# EasyEDA Pro project 光电转接板第二版.eprj

# Schematic Schematic1
Board Name: Board1; Create Date: 2025-05-01; Page Name: P1; Project Name: 光电转接板第二版; Schematic Name: Schematic1; Update Date: 2025-05-06; Company: 嘉立创EDA; Page Size: A4; Version: V1.0
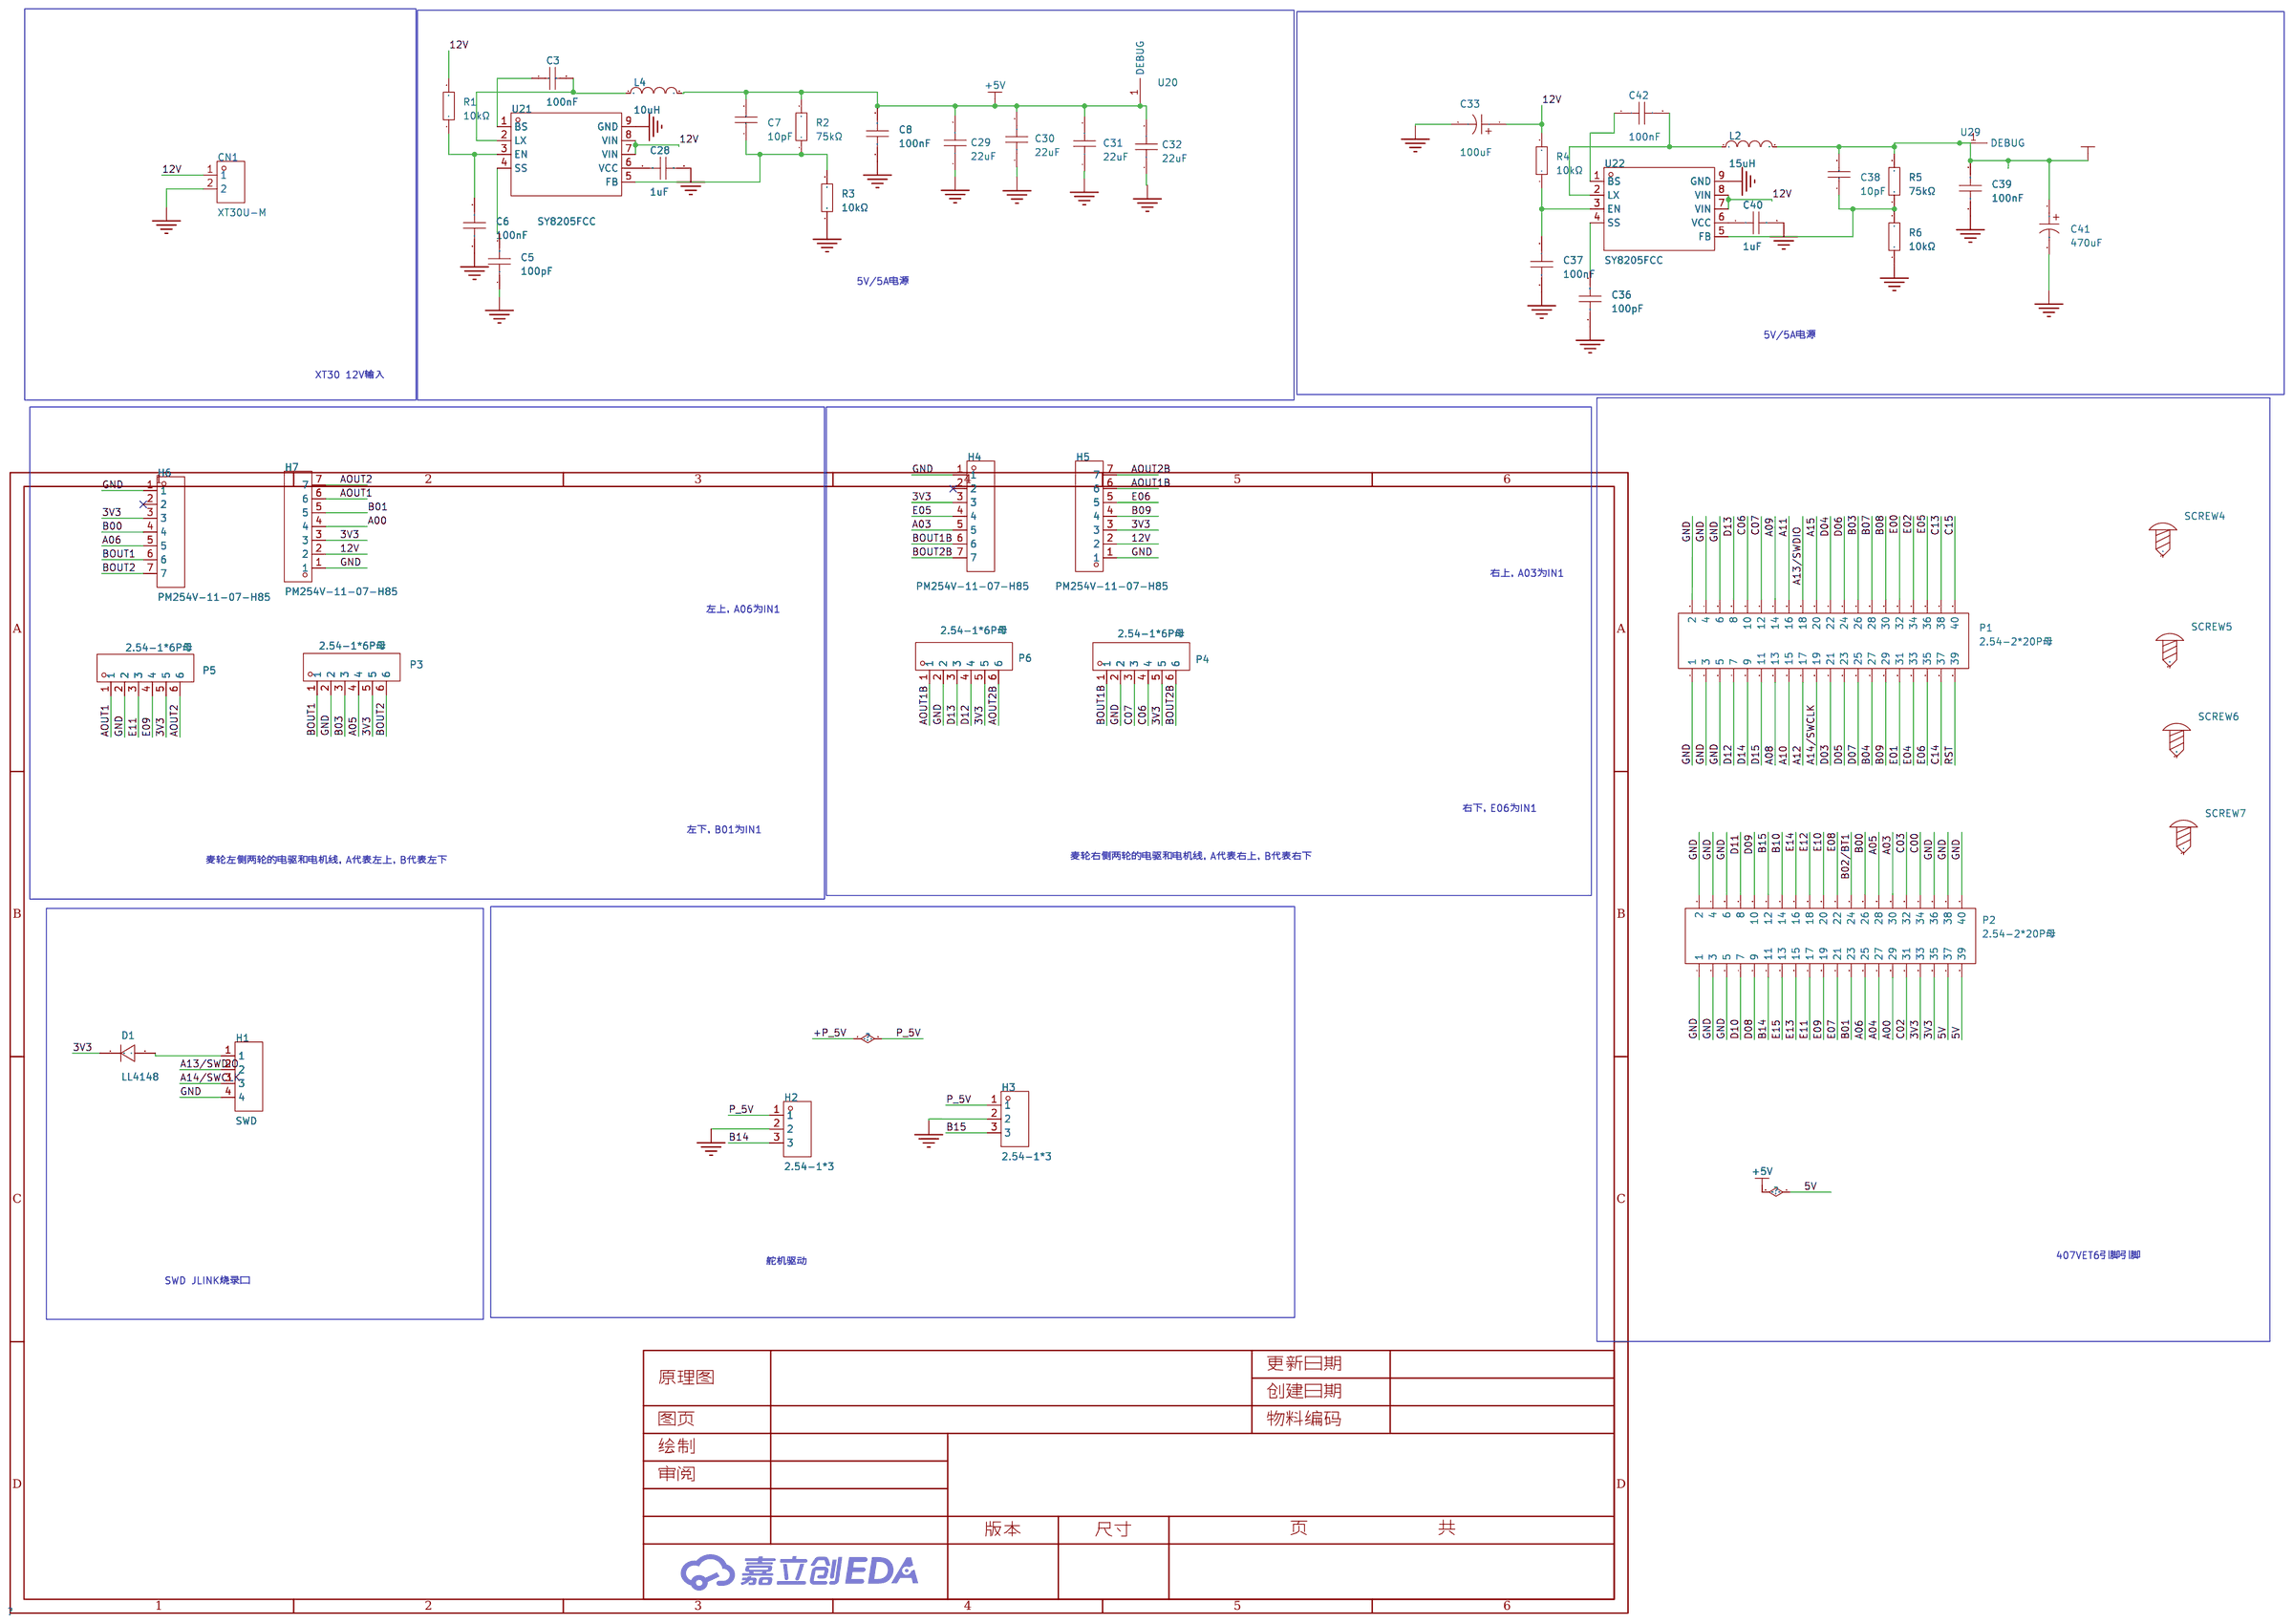
[diagram p0: schematic sheet]

## Parts
C3  100nF  [C1206]
C5  100pF  [C0603]
C6  100nF  [C0603]
C7  10pF  [C0603]
C8  100nF  [C0603]
C28  1uF  [C1206]
C29  22uF  [C0805]
C30  22uF  [C0805]
C31  22uF  [C0805]
C32  22uF  [C0805]
C33  100uF  [CAP-TH_BD6.3-P2.50-D1.0-FD]
C36  100pF  [C0603]
C37  100nF  [C0603]
C38  10pF  [C0603]
C39  100nF  [C0603]
C40  1uF  [C1206]
C41  470uF  [CAP-SMD_BD6.3-L6.6-W6.6-FD]
C42  100nF  [C0603]
CN1  XT30U-M  [CONN-TH_XT30U-M]
D1  LL4148  [LL-34_L3.5-W1.5-RD]
H1  SWD  [HDR-TH_4P-P2.54-H-M-W10.4]
H2  2.54-1*3  [HDR-TH_3P-P2.54-V-M-1]
H3  2.54-1*3  [HDR-TH_3P-P2.54-V-M-1]
H4  PM254V-11-07-H85  [HDR-TH_7P-P2.54-V-F]
H5  PM254V-11-07-H85  [HDR-TH_7P-P2.54-V-F]
H6  PM254V-11-07-H85  [HDR-TH_7P-P2.54-V-F]
H7  PM254V-11-07-H85  [HDR-TH_7P-P2.54-V-F]
L2  15uH  [IND-SMD_L7.1-W6.6]
L4  10uH  [IND-SMD_L5.4-W5.2_FXL0530]
P1  2.54-2*20P母  [HDR-TH_40P-P2.54-V-F-R2-C20-S2.54]
P2  2.54-2*20P母  [HDR-TH_40P-P2.54-V-F-R2-C20-S2.54]
P3  2.54-1*6P母  [HDR-TH_6P-P2.54-V-F]
P4  2.54-1*6P母  [HDR-TH_6P-P2.54-V-F]
P5  2.54-1*6P母  [HDR-TH_6P-P2.54-V-F]
P6  2.54-1*6P母  [HDR-TH_6P-P2.54-V-F]
R1  10kΩ  [R0603]
R2  75kΩ  [R0603]
R3  10kΩ  [R0603]
R4  10kΩ  [R0603]
R5  75kΩ  [R0603]
R6  10kΩ  [R0603]
SCREW4  -  [M3螺丝]
SCREW5  -  [M3螺丝]
SCREW6  -  [M3螺丝]
SCREW7  -  [M3螺丝]
U20  -  [DEBUG]
U21  SY8205FCC  [SOIC-8_L5.0-W4.0-P1.27-LS6.0-BL-EP2.0]
U22  SY8205FCC  [SOIC-8_L5.0-W4.0-P1.27-LS6.0-BL-EP2.0]
U29  -  [DEBUG]

## Library data of the parts
C3 = CL31B104KBCNNNC: 容值:100nF;精度:±10%;额定电压:50V;材质(温度系数):X7R;; LCSC Part Name: 100nF ±10% 50V; Supplier Part: C24497; Manufacturer: SAMSUNG(三星); Supplier Footprint: 1206; JLCPCB Part Class: 基础库; Datasheet: https://atta.szlcsc.com/upload/public/pdf/source/20160218/1457707763339.pdf; Supplier: LCSC; Tolerance: ±10%; Voltage Rated: 50V; Temperature Coefficient: X7R
C5 C36 = CC0603JRNPO9BN101: 容值:100pF;精度:±5%;额定电压:50V;材质(温度系数):NP0;; LCSC Part Name: 100pF ±5% 50V; Supplier Part: C14665; Manufacturer: YAGEO(国巨); Supplier Footprint: 0603; JLCPCB Part Class: 扩展库; Datasheet: https://atta.szlcsc.com/upload/public/pdf/source/20181008/C309499_21CC21451B82C39E3D92150FD6B30293.pdf; Supplier: LCSC; Tolerance: ±5%; Voltage Rated: 50V; Temperature Coefficient: NP0
C6 C8 C37 C39 C42 = CGA0603X7R104K500JT: 容值:100nF;精度:±10%;额定电压:50V;温度系数:X7R;; LCSC Part Name: 100nF ±10% 50V; Supplier Part: C6119867; Manufacturer: HRE(芯声); Supplier Footprint: 0603; JLCPCB Part Class: 扩展库; Datasheet: https://atta.szlcsc.com/upload/public/pdf/source/20250103/C44077DA9E7B3EFAE02F22B6D3D1CBC9.pdf; Supplier: LCSC; Tolerance: ±10%; Voltage Rating: 50V; Temperature Coefficient: X7R
C7 C38 = CC0603JRNPO9BN100: 容值:10pF;精度:±5%;额定电压:50V;材质(温度系数):NP0;; LCSC Part Name: 10pF ±5% 50V; Supplier Part: C106245; Manufacturer: YAGEO(国巨); Supplier Footprint: 0603; JLCPCB Part Class: 扩展库; Datasheet: https://atta.szlcsc.com/upload/public/pdf/source/20170505/1493957838062.pdf; Supplier: LCSC; Tolerance: ±5%; Voltage Rated: 50V; Temperature Coefficient: NP0
C28 C40 = 1206B105K500NT: 容值:1uF;精度:±10%;额定电压:50V;温度系数:X7R;; LCSC Part Name: 1uF ±10% 50V; Supplier Part: C90539; Manufacturer: FH(风华); Supplier Footprint: 1206; JLCPCB Part Class: 扩展库; Datasheet: https://atta.szlcsc.com/upload/public/pdf/source/20200305/C486355_26A10D38EF8C2A5C37091D0039909270.pdf; Supplier: LCSC; Tolerance: ±10%; Voltage Rating: 50V; Temperature Coefficient: X7R
C29-C32 = CGA0805X5R226M350MT: 容值:22uF;精度:±20%;额定电压:35V;材质(温度系数):X5R;; LCSC Part Name: 22uF ±20% 35V; Supplier Part: C6119901; Manufacturer: HRE(芯声); Supplier Footprint: 0805; JLCPCB Part Class: 扩展库; Datasheet: https://atta.szlcsc.com/upload/public/pdf/source/20231129/D589D0CC4D260F7AC3A77E53B455CCB3.pdf; Supplier: LCSC; Tolerance: ±20%; Voltage Rated: 35V; Temperature Coefficient: X5R
C33 = PA25V100M6x5: 容值:100uF;精度:±20%;额定电压:25V;纹波电流:2.69A@100Hz;等效串联电阻(ESR):30mΩ@100kHz;类型:-;; LCSC Part Name: 100uF ±20% 25V; Supplier Part: C46550438; Manufacturer: 捷而瑞; Supplier Footprint: 插件,D6.3xL5mm; JLCPCB Part Class: 扩展库; Datasheet: https://atta.szlcsc.com/upload/public/pdf/source/20250307/831193F737CAF6D75AC25F14E955F0EC.pdf; Supplier: LCSC; Tolerance: ±20%; Voltage Rating: 25V; Ripple Current: 2.69A@100Hz; Equivalent Series Resistance(ESR): 30mΩ@100kHz; Diameter: 6.3mm; Height - Seated (Max): 5mm; Lifetime: 2000hrs@105℃; Operating Temperature: -55℃~+105℃
C41 = GVT1A477M0608CNVC: 容值:470uF;精度:±20%;额定电压:10V;纹波电流:150mA@120Hz;; LCSC Part Name: 470uF ±20% 10V; Supplier Part: C2983309; Manufacturer: HRK(鸿瑞凯电子); Supplier Footprint: SMD,D6.3xL7.7mm; JLCPCB Part Class: 扩展库; Datasheet: https://atta.szlcsc.com/upload/public/pdf/source/20220321/3A4A82F9B7B0C8C257CAAADB11D703EA.pdf; Supplier: LCSC; Tolerance: ±20%; Rated Voltage: 10V; Ripple Current: 150mA@120Hz; φD: 6.3mm; L: 8mm; Lifetime @ Temp: 3000hrs@105℃; Operating Temperature: -55℃~+105℃
CN1 = XT30U-M: 类别:-;类型1:-;; LCSC Part Name: AMASS(艾迈斯)轻量版锂电池插头公头 XT30U-M; Supplier Part: C99101; Manufacturer: AMASS(艾迈斯); Datasheet: https://atta.szlcsc.com/upload/public/pdf/source/20170606/1496716542582.pdf; Supplier: LCSC; Brand: 艾迈斯; Type: 插头; Colour: 黄色; InterfaceType: 公头
D1 = LL4148_C435829: LCSC Part Name: 电压:75V 电流:200mA; Supplier Part: C435829; Manufacturer: MDD(辰达半导体); Supplier Footprint: LL-34; JLCPCB Part Class: 扩展库; Datasheet: https://atta.szlcsc.com/upload/public/pdf/source/20230823/CF1FBF721ECE2AB22ACED5F4B72E76C8.pdf; Supplier: LCSC; Forward Voltage (Vf@If): 1V@10mA; Reverse Voltage (Vr): 75V; Rectified Current: 200mA; Reverse Leakage Current: 5uA@75V; Reverse Recovery Time (trr): 4ns
H1 = 2.54-1*4P反弯排针: 插针结构:1x4P;间距:2.54mm;行距:-;圆针/方针:方针;安装方式:弯插;排数:单排;总PIN位数:4P;额定电流:3A;额定电压:-;配合针长度:6mm;塑高:-;端接针长度:-;触头材质:-;触头镀层:-;工作温度:-55℃~+105℃;颜色:黑色;; LCSC Part Name: 1x4P 间距:2.54mm 方针 弯插; Supplier Part: C91552; Manufacturer: BOOMELE(博穆精密); Supplier Footprint: 弯插,P=2.54mm; Datasheet: https://atta.szlcsc.com/upload/public/pdf/source/20190508/C74252_03DDEC4696EE17172E44B96636392962.pdf; Supplier: LCSC; Pin Structure: 1x4P; Pitch: 2.54mm; Circluar Pins/Square Pins: 方针; Mounting Type: 弯插; Number of Rows: 单排; Number of Pins: 4P; Current Rating: 3A; Length of Mating Pin: 6mm; Operating Temperature: -55℃~+105℃; Color: 黑色
H2 H3 = 2.54-1*3: 插针结构:1x3P;间距:2.54mm;排数:单排;总PIN位数:3P;触头镀层:金;; LCSC Part Name: 停产; Supplier Part: C5116482; Manufacturer: ZHOURI(洲日); Supplier Footprint: 插件,P=2.54mm; JLCPCB Part Class: 扩展库; Datasheet: https://atta.szlcsc.com/upload/public/pdf/source/20220729/4DB71EF9013296CFACD97372BAB8A1F0.pdf; Supplier: LCSC; Pin Structure: 1x3P; Pitch: 2.54mm; Number of Rows: 单排; Number of Pins: 3P; Contact Plating: 金
H4-H7 = PM254V-11-07-H85: 插孔结构:1x7P;间距:2.54mm;行距:-;圆孔/方孔:方孔;安装类型:直插;排数:单排;总孔位数:7P;额定电流:3A;额定电压:250V;插孔方向:顶部;塑高:-;工作温度范围:-40℃~+105℃;; LCSC Part Name: 间距:2.54mm 1x7P 直插; Supplier Part: C2832270; Manufacturer: XFCN(兴飞); Supplier Footprint: 插件,P=2.54mm; JLCPCB Part Class: 扩展库; Datasheet: https://atta.szlcsc.com/upload/public/pdf/source/20210514/C2832270_F424CC0071A81298BFB56B53406F9842.pdf; Supplier: LCSC; Holes Structure: 1x7P; Pitch: 2.54mm; Circular Hole / Square Hole: 方孔; Mounting Type: 直插; Number of Rows: 单排; Number of Holes: 7P; Current Rating (Max): 3A; Voltage Rating (Max): 250V; Holes Direction: 顶部; Operating Temperature Range: -40℃~+105℃
L2 = SMMS0650-150M: 电感值:15uH;精度:±20%;额定电流:3.1A;饱和电流(Isat):5A;类型:一体成型电感;; LCSC Part Name: 15uH ±20% 5A; Supplier Part: C149585; Manufacturer: SXN(顺翔诺); Supplier Footprint: SMD,6.6x7.1mm; JLCPCB Part Class: 扩展库; Datasheet: https://atta.szlcsc.com/upload/public/pdf/source/20210810/BBF24330FB2F5029F637830BA9C42C0D.pdf; Supplier: LCSC; Tolerance: ±20%; Rated Current: 3.1A; Saturation Current (Isat): 5A; DC Resistance (DCR): 85mΩ; Type: 一体成型电感
L4 = FXL0530-100-M: 电感值:10uH;精度:±20%;额定电流:3.2A;饱和电流(Isat):3.5A;类型:一体成型电感;; LCSC Part Name: 10uH ±20% 3.5A; Supplier Part: C177248; Manufacturer: cjiang(长江微电); Supplier Footprint: SMD,5.2x5.4mm; JLCPCB Part Class: 扩展库; Datasheet: https://atta.szlcsc.com/upload/public/pdf/source/20240426/3189EA8206330E2108542F9E34E540E7.pdf; Supplier: LCSC; Tolerance: ±20%; Rated Current: 3.2A; Saturation Current (Isat): 3.5A; DC Resistance (DCR): 125mΩ; Type: 一体成型电感
P1 P2 = 2.54-2*20P母: 间距:2.54mm;总孔位数:40;排数:2;插孔结构:2x20P;行距:2.54mm;安装类型:直插;塑高:-;触头材质:黄铜;触头镀层:-;; LCSC Part Name: 2.54mm 2x20P; Supplier Part: C50982; Manufacturer: BOOMELE(博穆精密); Supplier Footprint: 直插,P=2.54mm; JLCPCB Part Class: Extended Part; Datasheet: https://atta.szlcsc.com/upload/public/pdf/source/20151109/1457707571530.pdf; Supplier: LCSC; Pitch: 2.54mm; Number of Holes: 40; Number of Rows: 2; Holes Structure: 2x20P; Row Spacing: 2.54mm; Mounting Type: 直插; Contact Material: 黄铜
P3-P6 = 2.54-1*6P母: 间距:2.54mm;总孔位数:6;排数:1;插孔结构:1x6P;行距:-;安装类型:直插;塑高:-;触头材质:-;触头镀层:-;; LCSC Part Name: 2.54mm 1x6P; Supplier Part: C40877; Manufacturer: BOOMELE(博穆精密); Supplier Footprint: 直插,P=2.54mm; JLCPCB Part Class: Extended Part; Datasheet: https://atta.szlcsc.com/upload/public/pdf/source/20151109/1457707559772.pdf; Supplier: LCSC; Pitch: 2.54mm; Number of Holes: 6; Number of Rows: 1; Holes Structure: 1x6P; Mounting Type: 直插
R1 R3 R4 R6 = 0603WAF1002T5E: 电阻类型:厚膜电阻;阻值:10kΩ;精度:±1%;功率:100mW;最大工作电压:75V;温度系数:±100ppm/℃;; LCSC Part Name: 厚膜电阻 10kΩ ±1% 100mW; Supplier Part: C25804; Manufacturer: UNI-ROYAL(厚声); Supplier Footprint: 0603; JLCPCB Part Class: 基础库; Datasheet: https://atta.szlcsc.com/upload/public/pdf/source/20200306/C422600_1E6D84923E4A46A82E41ADD87F860B5C.pdf; Supplier: LCSC; Type: 厚膜电阻; Tolerance: ±1%; Power(Watts): 100mW; Overload Voltage (Max): 75V; Temperature Coefficient: ±100ppm/℃; Operating Temperature Range: -55℃~+155℃
R2 R5 = 0603WAF7502T5E: 电阻类型:厚膜电阻;阻值:75kΩ;精度:±1%;功率:100mW;最大工作电压:75V;温度系数:±100ppm/℃;; LCSC Part Name: 75kΩ ±1% 100mW 厚膜电阻; Supplier Part: C23242; Manufacturer: UNI-ROYAL(厚声); Supplier Footprint: 0603; JLCPCB Part Class: 基础库; Datasheet: https://atta.szlcsc.com/upload/public/pdf/source/20200306/C422600_1E6D84923E4A46A82E41ADD87F860B5C.pdf; Supplier: LCSC; Type: 厚膜电阻; Tolerance: ±1%; Power(Watts): 100mW; Overload Voltage (Max): 75V; Temperature Coefficient: ±100ppm/℃; Operating Temperature Range: -55℃~+155℃
SCREW4-SCREW7 = M3螺丝: Supplier Footprint: 插件
U20 U29 = DEBUG
U21 U22 = SY8205FCC: 功能类型:降压型;输出类型:-;工作电压:4.5V~30V;输出电压:-;输出电流:5A;; LCSC Part Name: 高效快速响应5A 30V输入同步降压稳压器; Supplier Part: C111875; Manufacturer: silergy(矽力杰); Supplier Footprint: SOIC-8-EP; JLCPCB Part Class: 扩展库; Datasheet: https://atta.szlcsc.com/upload/public/pdf/source/20180224/C111875_15194360670851363275.pdf; Supplier: LCSC; Function: 降压型; Input Voltage: 4.5V~30V; Output Current: 5A; Switching Frequency: 500kHz; Operating Temperature: -40℃~+125℃; Synchronous Rectification: 是; Topology: 降压式; Quiescent Current (Iq): 200uA; Switch tube (built-in/external): 内置

## Nets
3V3: D1.1(C) H4.3 H5.3 H6.3 H7.3 P2.33 P2.35 P3.5 P4.5 P5.5 P6.5
12V: C33.1 CN1.1 H5.2 H7.2 R1.2 R4.2 U21.7(VIN) U21.8(VIN) U22.7(VIN) U22.8(VIN)
+5V: C7.2 C8.2 C29.2 C30.2 C31.2 C32.2 L4.2 P2.37 P2.39 R2.2 U20.1(DEBUG)
GND: C5.1 C6.1 C8.1 C28.2 C32.1 C33.2 C36.1 C37.1 C39.1 C40.2 CN1.2 H1.4 H3.2 H4.1 H5.1 H6.1 H7.1 P1.1 P1.2 P1.3 P1.4 P1.5 P1.6 P2.1 P2.2 P2.3 P2.4 P2.5 P2.6 P2.36 P2.38 P2.40 P3.2 P4.2 P5.2 P6.2 R3.1 R6.1 U21.9(GND) U22.9(GND)
+P_5V: C38.2 C39.2 C41.1 H2.1 H3.1 L2.2 R5.2 U29.1(DEBUG)
A00: H7.4 P2.29
A03: H4.5 P2.30
A04: P2.27
A05: P2.28 P3.4
A06: H6.5 P2.25
A08: P1.13
A09: P1.14
A10: P1.15
A11: P1.16
A12: P1.17
A13/SWDIO: H1.2 P1.18
A14/SWCLK: H1.3 P1.19
A15: P1.20
AOUT1: H7.6 P5.1
AOUT1B: H5.6 P6.1
AOUT2: H7.7 P5.6
AOUT2B: H5.7 P6.6
B00: H6.4 P2.26
B01: H7.5 P2.23
B02/BT1: P2.24
B03: P1.26 P3.3
B04: P1.27
B07: P1.28
B08: P1.30
B09: H5.4 P1.29
B10: P2.14
B14: H2.3 P2.11
B15: H3.3 P2.12
BOUT1: H6.6 P3.1
BOUT1B: H4.6 P4.1
BOUT2: H6.7 P3.6
BOUT2B: H4.7 P4.6
C00: P2.34
C02: P2.31
C03: P2.32
C06: P1.10 P4.4
C07: P1.12 P4.3
C13: P1.38
C14: P1.37
C15: P1.40
D03: P1.21
D04: P1.22
D05: P1.23
D06: P1.24
D07: P1.25
D08: P2.9
D09: P2.10
D10: P2.7
D11: P2.8
D12: P1.7 P6.4
D13: P1.8 P6.3
D14: P1.9
D15: P1.11
E00: P1.32
E01: P1.31
E02: P1.34
E04: P1.33
E05: H4.4 P1.36
E06: H5.5 P1.35
E07: P2.21
E08: P2.22
E09: P2.19 P5.4
E10: P2.20
E11: P2.17 P5.3
E12: P2.18
E13: P2.15
E14: P2.16
E15: P2.13
RST: P1.39
$1N856: C3.2 L4.1 U21.2(LX)
$1N857: C7.1 R2.1 R3.2 U21.5(FB)
$1N858: C5.2 U21.4(SS)
$1N864: C6.2 R1.1 U21.3(EN)
$1N865: C28.1 U21.6(VCC)
$1N867: C3.1 U21.1(BS)
$1N1560: C38.1 R5.1 R6.2 U22.5(FB)
$1N1561: C36.2 U22.4(SS)
$1N1567: C37.2 R4.1 U22.3(EN)
$1N1568: C40.1 U22.6(VCC)
$1N1570: C42.1 U22.1(BS)
$1N2169: D1.2(A) H1.1
$1N7357: C42.2 L2.1 U22.2(LX)

Not connected (* = marked no-connect by the designer): C29 1; C30 1; C31 1; C41 2; H2 2; H4 2*; H6 2*; SCREW4 1; SCREW5 1; SCREW6 1; SCREW7 1

## Notes on the sheet
- 5V/5A电源
- 5V/5A电源
- XT30 12V输入
- 右上，A03为IN1
- 左上，A06为IN1
- 右下，E06为IN1
- 左下，B01为IN1
- 麦轮左侧两轮的电驱和电机线，A代表左上，B代表左下
- 麦轮右侧两轮的电驱和电机线，A代表右上，B代表右下
- 舵机驱动
- 407VET6引脚引脚
- SWD JLINK烧录口

# Schematic Schematic2
Create Date: 2025-05-05; Page Name: P1; Project Name: 光电转接板第二版; Schematic Name: Schematic2; Update Date: 2025-05-06; Company: 嘉立创EDA; Page Size: A4; Version: V1.0
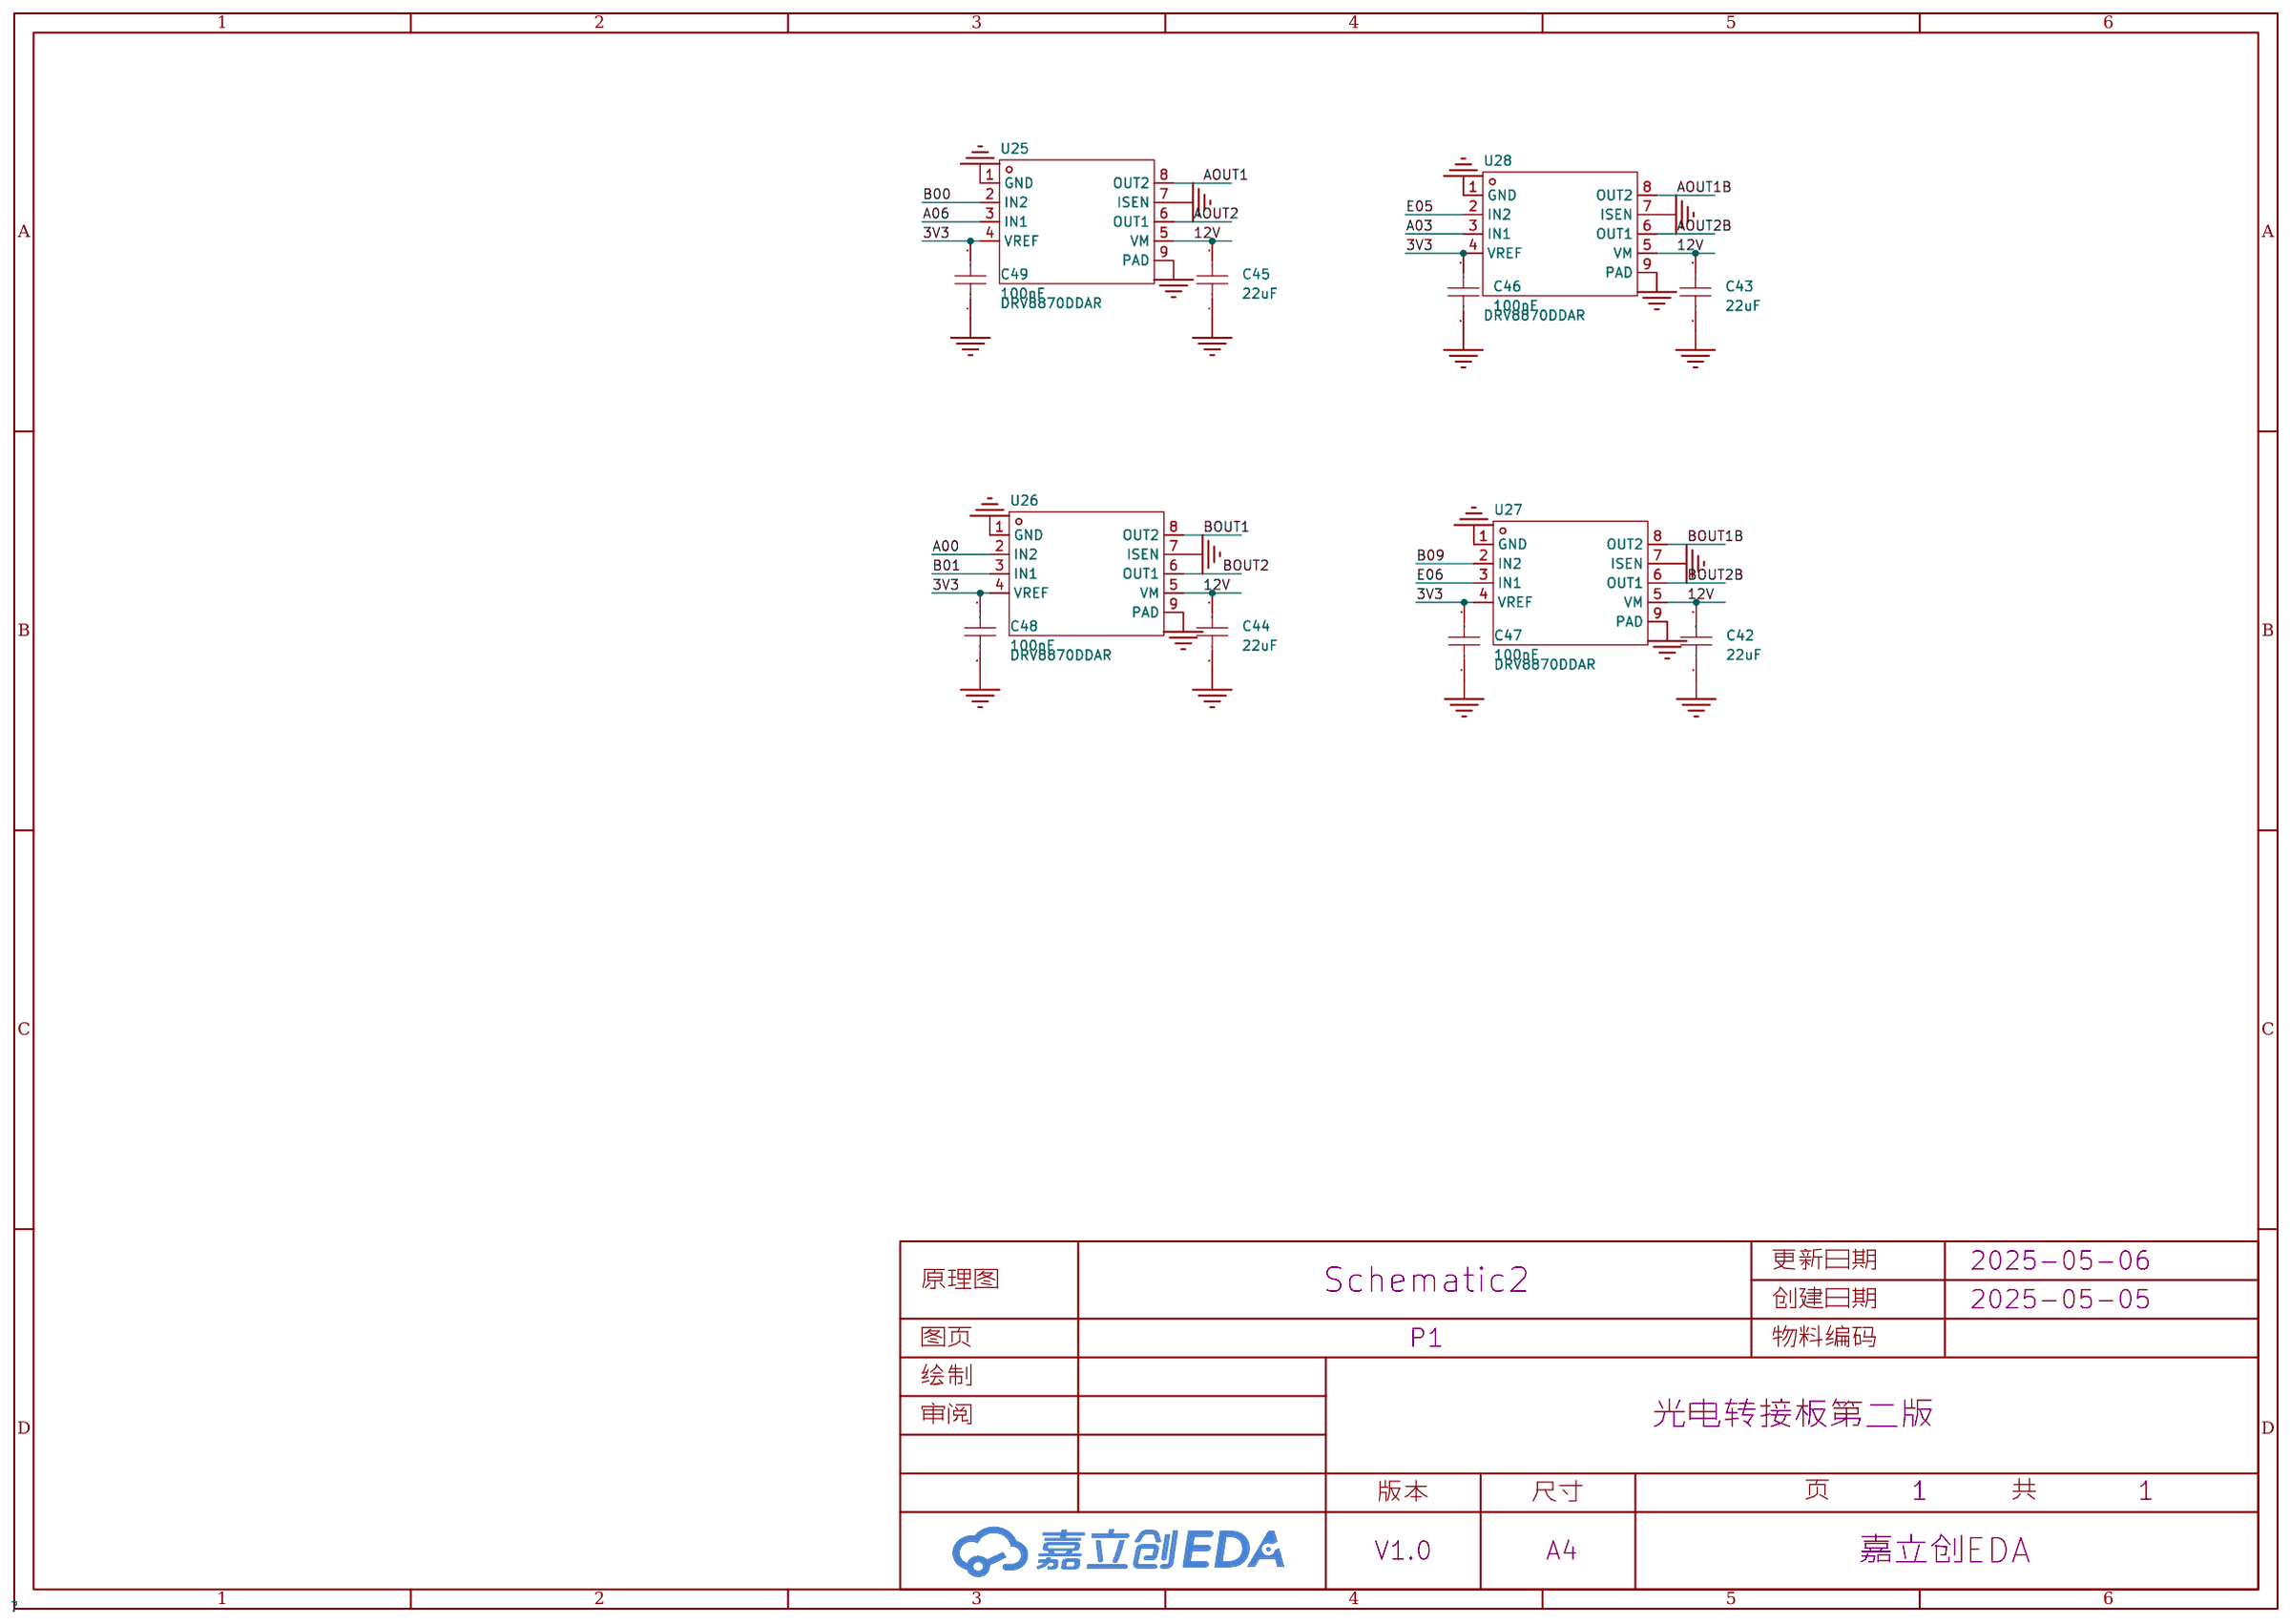
[diagram p1: schematic sheet]

## Parts
C42  22uF  [C0805]
C43  22uF  [C0805]
C44  22uF  [C0805]
C45  22uF  [C0805]
C46  100nF  [C0603]
C47  100nF  [C0603]
C48  100nF  [C0603]
C49  100nF  [C0603]
U25  DRV8870DDAR  [HSOP-8_L5.0-W4.0-P1.27-LS6.2-BL-EP]
U26  DRV8870DDAR  [HSOP-8_L5.0-W4.0-P1.27-LS6.2-BL-EP]
U27  DRV8870DDAR  [HSOP-8_L5.0-W4.0-P1.27-LS6.2-BL-EP]
U28  DRV8870DDAR  [HSOP-8_L5.0-W4.0-P1.27-LS6.2-BL-EP]

## Library data of the parts
C42-C45 = CGA0805X5R226M350MT: 容值:22uF;精度:±20%;额定电压:35V;材质(温度系数):X5R;; LCSC Part Name: 22uF ±20% 35V; Supplier Part: C6119901; Manufacturer: HRE(芯声); Supplier Footprint: 0805; JLCPCB Part Class: 扩展库; Datasheet: https://atta.szlcsc.com/upload/public/pdf/source/20231129/D589D0CC4D260F7AC3A77E53B455CCB3.pdf; Supplier: LCSC; Tolerance: ±20%; Voltage Rated: 35V; Temperature Coefficient: X5R
C46-C49 = CGA0603X7R104K500JT: 容值:100nF;精度:±10%;额定电压:50V;温度系数:X7R;; LCSC Part Name: 100nF ±10% 50V; Supplier Part: C6119867; Manufacturer: HRE(芯声); Supplier Footprint: 0603; JLCPCB Part Class: 扩展库; Datasheet: https://atta.szlcsc.com/upload/public/pdf/source/20250103/C44077DA9E7B3EFAE02F22B6D3D1CBC9.pdf; Supplier: LCSC; Tolerance: ±10%; Voltage Rating: 50V; Temperature Coefficient: X7R
U25-U28 = DRV8870DDAR: DRV8870 具有电流调节功能的 50V、3.6A、H 桥电机驱动器; Supplier Part: C86590; Manufacturer: TI(德州仪器); Supplier Footprint: HSOP-8-EP; JLCPCB Part Class: 扩展库; Datasheet: https://www.ti.com/cn/lit/gpn/drv8870; Supplier: LCSC

## Nets
3V3: C46.2 C47.2 C48.2 C49.2 U25.4(VREF) U26.4(VREF) U27.4(VREF) U28.4(VREF)
12V: C42.2 C43.2 C44.2 C45.2 U25.5(VM) U26.5(VM) U27.5(VM) U28.5(VM)
GND: C42.1 C43.1 C44.1 C45.1 C46.1 C47.1 C48.1 C49.1 U25.1(GND) U25.7(ISEN) U25.9(PAD) U26.1(GND) U26.7(ISEN) U26.9(PAD) U27.1(GND) U27.7(ISEN) U27.9(PAD) U28.1(GND) U28.7(ISEN) U28.9(PAD)
A00: U26.2(IN2)
A03: U28.3(IN1)
A06: U25.3(IN1)
AOUT1: U25.8(OUT2)
AOUT1B: U28.8(OUT2)
AOUT2: U25.6(OUT1)
AOUT2B: U28.6(OUT1)
B00: U25.2(IN2)
B01: U26.3(IN1)
B09: U27.2(IN2)
BOUT1: U26.8(OUT2)
BOUT1B: U27.8(OUT2)
BOUT2: U26.6(OUT1)
BOUT2B: U27.6(OUT1)
E05: U28.2(IN2)
E06: U27.3(IN1)

# Board PCB1
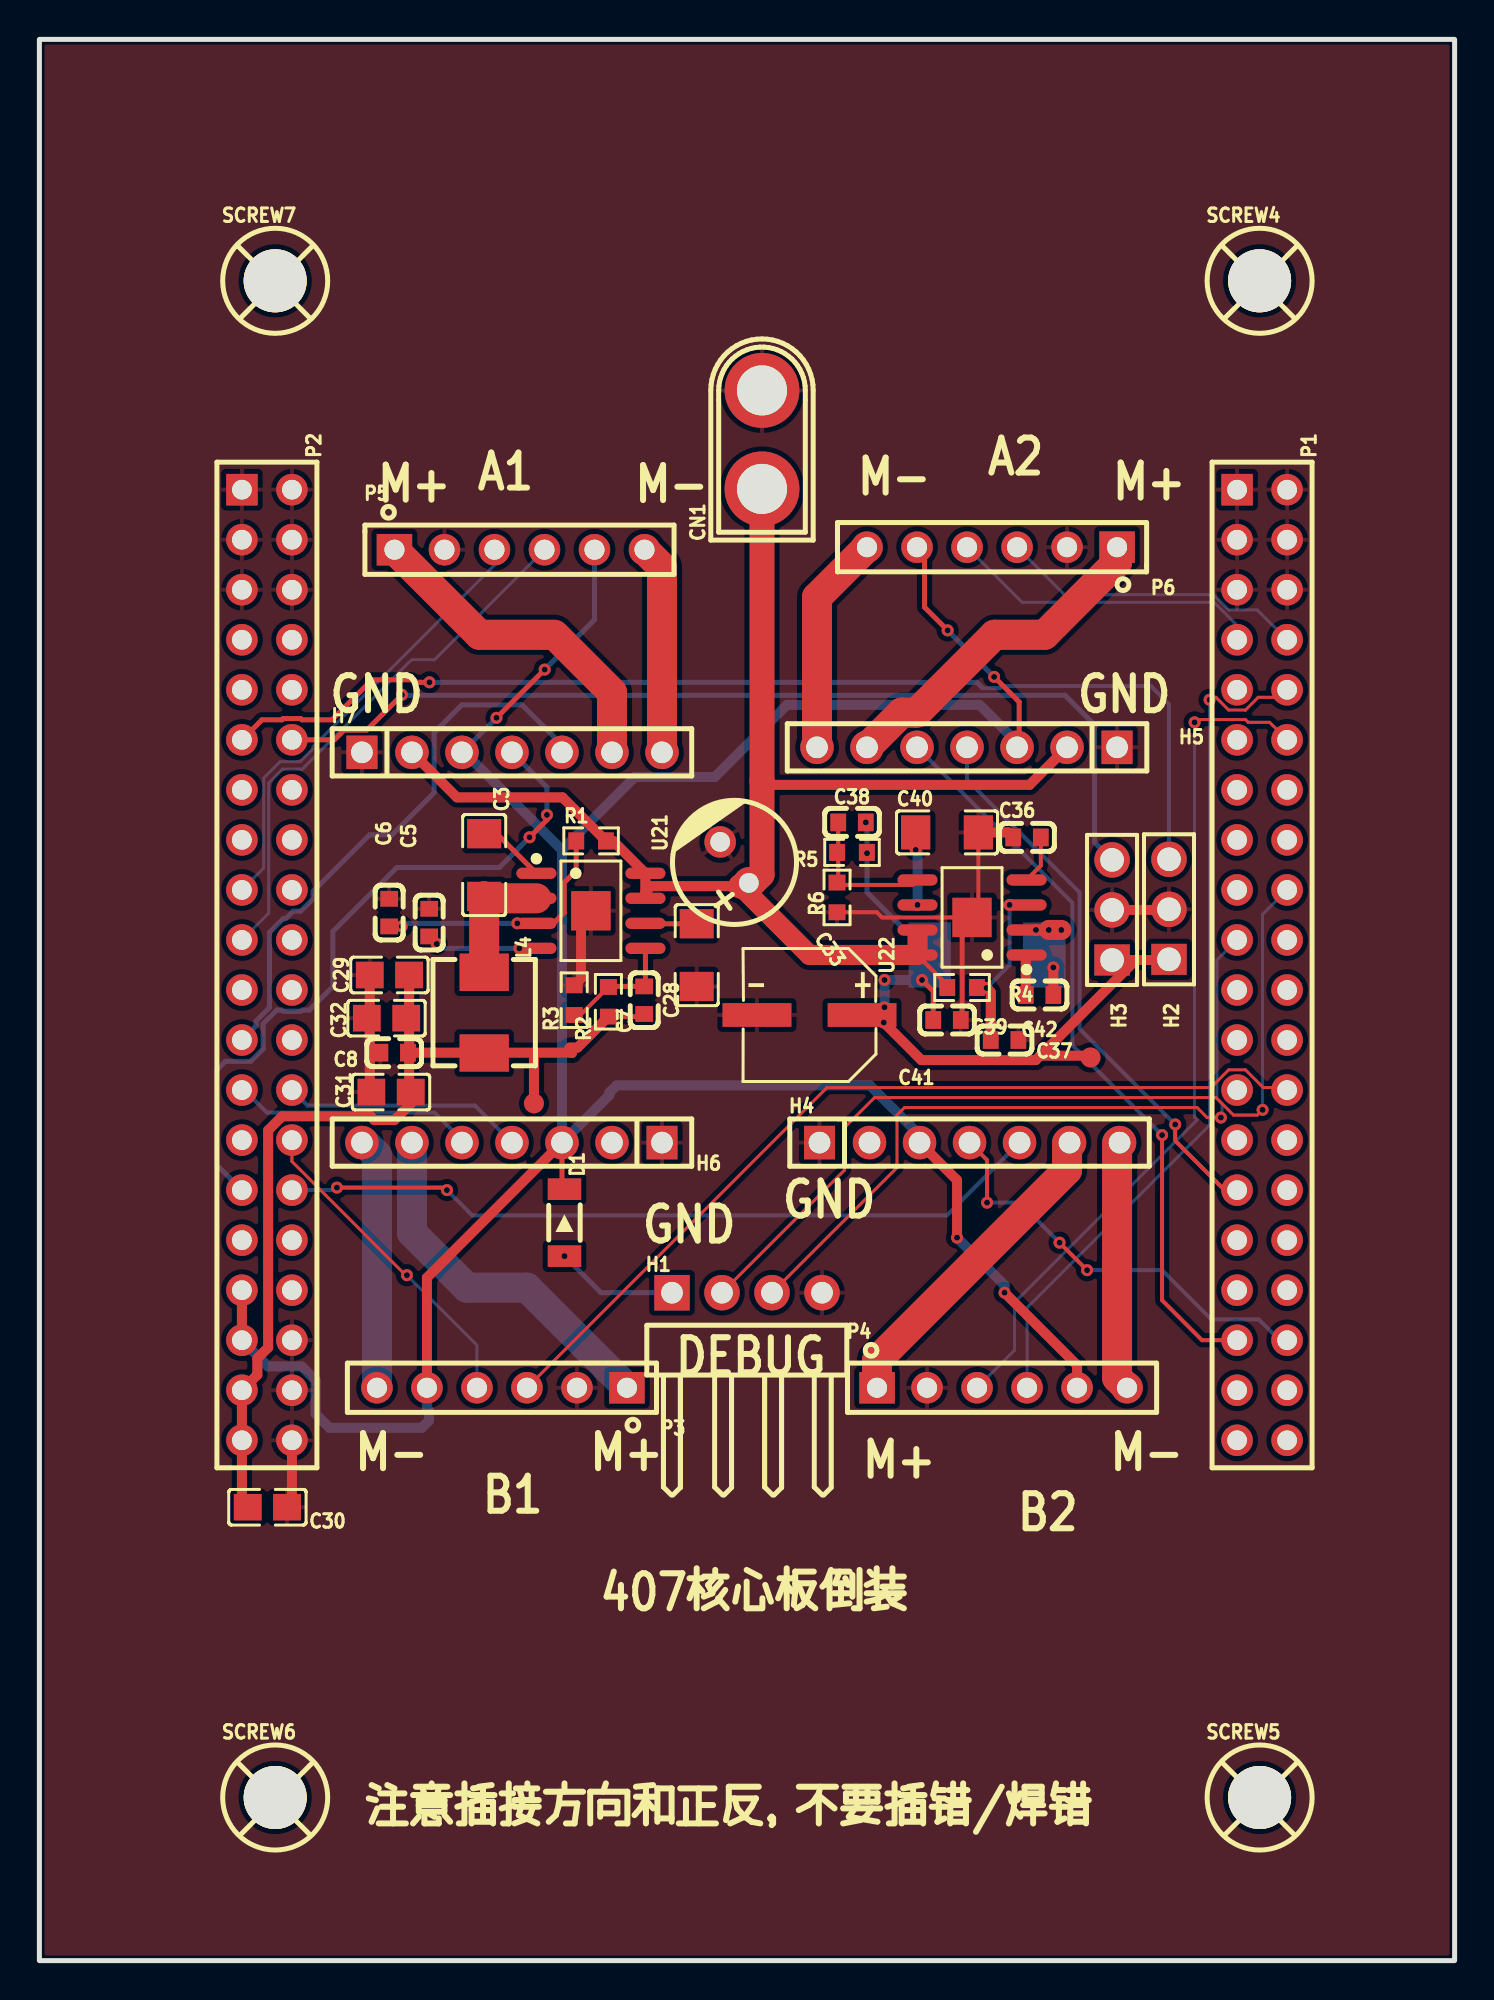
[diagram p2: board, top side]
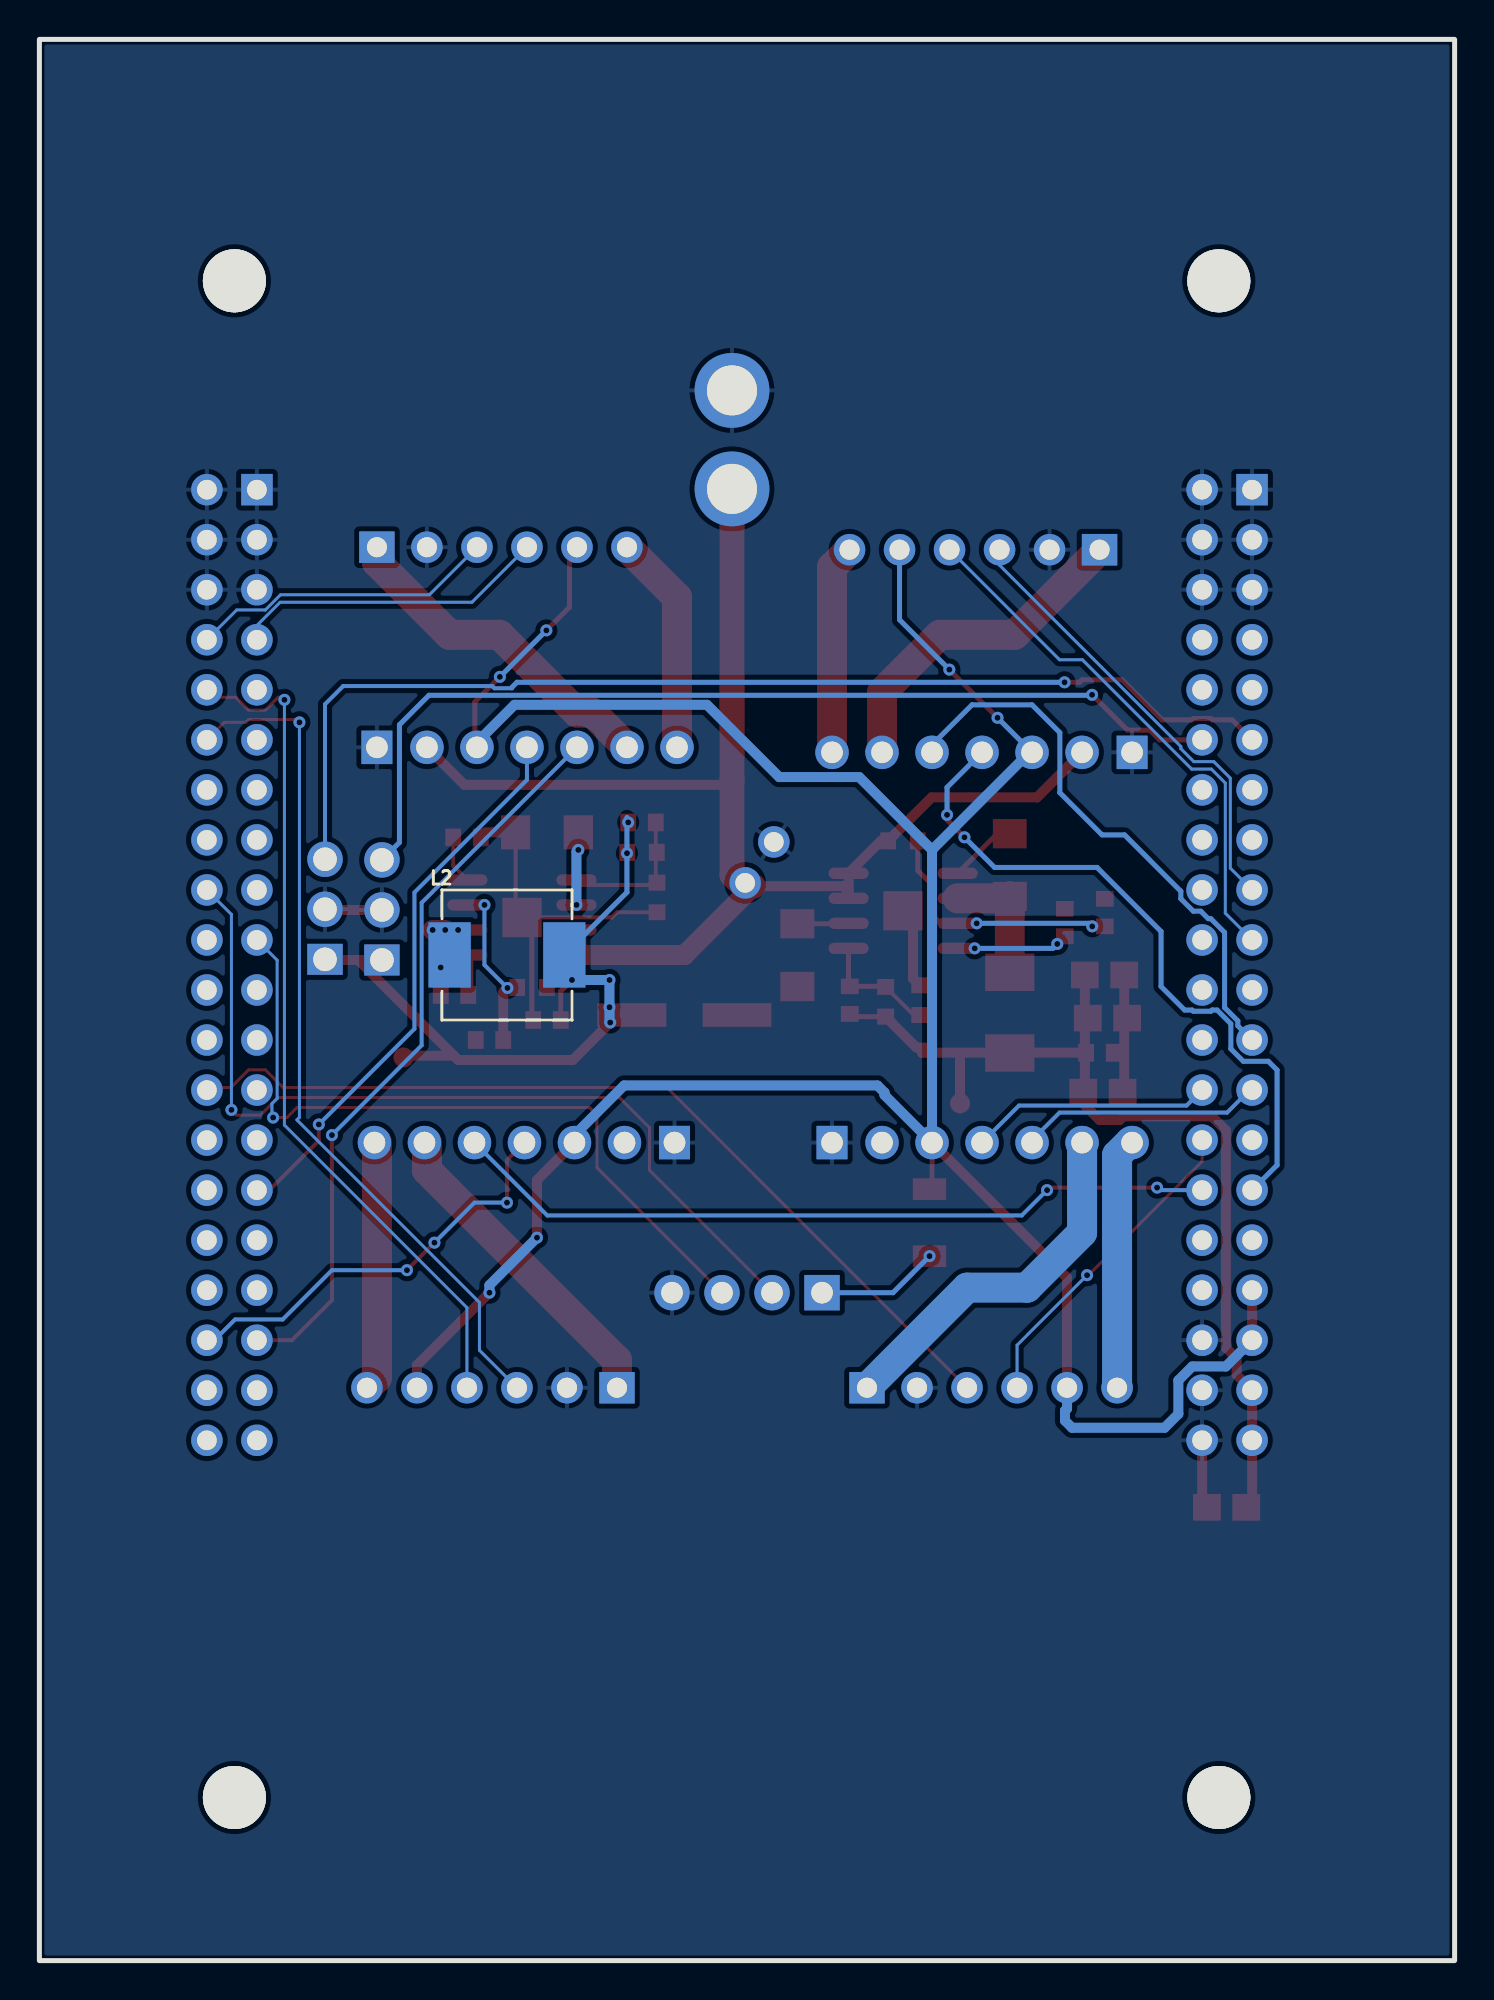
[diagram p3: board, bottom side, seen from below]

Outline 71.88 x 97.54 mm; copper layers: Top Layer, Bottom Layer. Coordinates in mm from the lower left corner of the outline.
Outline path: rectangle 0,97.54 71.88,0
Stack: Top Layer 0.035mm / Dielectric1 1.51mm FR4 er 4.5 / Bottom Layer 0.035mm

## Design rules (mm)
template: 自定义配置
spacing copperThickness1oz (default): track to track 0.102, other pairs 0.152 to 0.3
spacing copperThickness2oz: track to track 0.203, other pairs 0.152 to 0.3
track width copperThickness1oz (default): min 0.127, default 0.254, max 2.54
track width copperThickness2oz: min 0.203, default 0.254, max 2.54
differential pair differentialPair (default): width min 0.127, default 0.254, max 2.54; gap min 0.152, default 0.152
via viaSize (default): diameter min 0.5, default 0.61, max 10; hole min 0.3, default 0.305, max 6.3

## Placement (name value [footprint] x y rotation side)
C3  100nF  [C1206]  22.59 55.62 270 top
C5  100pF  [C0603]  19.8 52.7 270 top
C6  100nF  [C0603]  17.77 53.21 270 top
C7  10pF  [C0603]  30.72 48.76 270 top
C8  100nF  [C0603]  18.02 46.09 0 top
C28  1uF  [C1206]  33.39 51.05 270 top
C29  22uF  [C0805]  17.78 50.04 0 top
C30  22uF  [C0805]  11.58 23.02 180 top
C31  22uF  [C0805]  17.86 44.09 0 top
C32  22uF  [C0805]  17.63 47.85 0 top
C33  100uF  [CAP-TH_BD6.3-P2.50-D1.0-FD]  35.31 55.75 125 top
C36  100pF  [C0603]  50.16 57.02 0 top
C37  100nF  [C0603]  49.02 46.74 180 top
C38  10pF  [C0603]  41.28 57.79 0 top
C39  100nF  [C0603]  46.1 47.75 180 top
C40  1uF  [C1206]  46.1 57.28 0 top
C41  470uF  [CAP-SMD_BD6.3-L6.6-W6.6-FD]  39.12 48.01 180 top
C42  100nF  [C0603]  50.8 49.02 0 top
CN1  XT30U-M  [CONN-TH_XT30U-M]  36.7 77.22 90 top
D1  LL4148  [LL-34_L3.5-W1.5-RD]  26.67 37.47 270 top
H1  SWD  [HDR-TH_4P-P2.54-H-M-W10.4]  35.94 33.91 0 top
H2  2.54-1*3  [HDR-TH_3P-P2.54-V-M-1]  57.38 53.37 90 top
H3  2.54-1*3  [HDR-TH_3P-P2.54-V-M-1]  54.48 53.34 90 top
H4  PM254V-11-07-H85  [HDR-TH_7P-P2.54-V-F]  47.24 41.53 0 top
H5  PM254V-11-07-H85  [HDR-TH_7P-P2.54-V-F]  47.12 61.6 180 top
H6  PM254V-11-07-H85  [HDR-TH_7P-P2.54-V-F]  24 41.53 180 top
H7  PM254V-11-07-H85  [HDR-TH_7P-P2.54-V-F]  24 61.34 0 top
L2  15uH  [IND-SMD_L7.1-W6.6]  48.13 51.05 180 bottom
L4  10uH  [IND-SMD_L5.4-W5.2_FXL0530]  22.59 48.13 270 top
P1  2.54-2*20P母  [HDR-TH_40P-P2.54-V-F-R2-C20-S2.54]  62.1 50.55 270 top
P2  2.54-2*20P母  [HDR-TH_40P-P2.54-V-F-R2-C20-S2.54]  11.56 50.55 270 top
P3  2.54-1*6P母  [HDR-TH_6P-P2.54-V-F]  23.5 29.08 180 top
P4  2.54-1*6P母  [HDR-TH_6P-P2.54-V-F]  48.89 29.08 0 top
P5  2.54-1*6P母  [HDR-TH_6P-P2.54-V-F]  24.38 71.63 0 top
P6  2.54-1*6P母  [HDR-TH_6P-P2.54-V-F]  48.39 71.76 180 top
R1  10kΩ  [R0603]  28.02 56.85 0 top
R2  75kΩ  [R0603]  28.9 48.68 270 top
R3  10kΩ  [R0603]  27.16 48.76 270 top
R4  10kΩ  [R0603]  46.86 49.4 180 top
R5  75kΩ  [R0603]  41.28 56.26 0 top
R6  10kΩ  [R0603]  40.51 53.98 90 top
SCREW4  -  [M3螺丝]  62.04 85.22 0 top
SCREW5  -  [M3螺丝]  62.04 8.22 0 top
SCREW6  -  [M3螺丝]  12.04 8.22 0 top
SCREW7  -  [M3螺丝]  12.04 85.22 0 top
U20  -  [DEBUG]  25.12 43.52 0 top
U21  SY8205FCC  [SOIC-8_L5.0-W4.0-P1.27-LS6.0-BL-EP2.0]  28.01 53.3 270 top
U22  SY8205FCC  [SOIC-8_L5.0-W4.0-P1.27-LS6.0-BL-EP2.0]  47.37 52.96 90 top
U29  -  [DEBUG]  53.39 45.85 0 top

## Footprints (pads in the part's own frame, mm; a bottom-side part is the same pattern mirrored in y, then rotated)
C0603
  rect 0.8x0.9 smd: 1(-0.7,0) 2(0.7,0)
C0805
  rect 1.41x1.35 smd: 1(-1,0) 2(1,0)
C1206
  rect 1.485x1.728 smd: 1(-1.593,0) 2(1.593,0)
CAP-SMD_BD6.3-L6.6-W6.6-FD
  rect 3.5x1.2 smd: 1(-2.67,0) 2(2.67,0)
CAP-TH_BD6.3-P2.50-D1.0-FD
  round 1.6 hole 1: 1(-1.27,0) 2(1.27,0)
CONN-TH_XT30U-M
  round 3.8 hole 2.54: 1(-2.5,0) 2(2.5,0)
DEBUG
  round 1.016 smd: 1(0,0)
HDR-TH_3P-P2.54-V-M-1
  rect 1.575x1.8 hole 1.2: 1(-2.54,0)
  round 1.8 hole 1.2: 2(0,0) 3(2.54,0)
HDR-TH_4P-P2.54-H-M-W10.4
  rect 1.8x1.8 hole 1.1: 1(-3.81,0)
  round 1.8 hole 1.1: 2(-1.27,0) 3(1.27,0) 4(3.81,0)
HDR-TH_6P-P2.54-V-F
  rect 1.8x1.6 hole 1.02: 1(-6.35,0)
  round 1.6 hole 1.02: 2(-3.81,0) 3(-1.27,0) 4(1.27,0) 5(3.81,0) 6(6.35,0)
HDR-TH_7P-P2.54-V-F
  rect 1.575x1.7 hole 1.1: 1(-7.62,0)
  round 1.7 hole 1.1: 2(-5.08,0) 3(-2.54,0) 4(0,0) 5(2.54,0) 6(5.08,0) 7(7.62,0)
HDR-TH_40P-P2.54-V-F-R2-C20-S2.54
  rect 1.6x1.6 hole 1: 1(-24.13,-1.27)
  round 1.6 hole 1: 2(-24.13,1.27) 3(-21.59,-1.27) 4(-21.59,1.27) 5(-19.05,-1.27) 6(-19.05,1.27) 7(-16.51,-1.27) 8(-16.51,1.27) 9(-13.97,-1.27) 10(-13.97,1.27) 11(-11.43,-1.27) 12(-11.43,1.27) 13(-8.89,-1.27) 14(-8.89,1.27) 15(-6.35,-1.27) 16(-6.35,1.27) 17(-3.81,-1.27) 18(-3.81,1.27) 19(-1.27,-1.27) 20(-1.27,1.27) 21(1.27,-1.27) 22(1.27,1.27) 23(3.81,-1.27) 24(3.81,1.27) 25(6.35,-1.27) 26(6.35,1.27) 27(8.89,-1.27) 28(8.89,1.27) 29(11.43,-1.27) 30(11.43,1.27) 31(13.97,-1.27) 32(13.97,1.27) 33(16.51,-1.27) 34(16.51,1.27) 35(19.05,-1.27) 36(19.05,1.27) 37(21.59,-1.27) 38(21.59,1.27) 39(24.13,-1.27) 40(24.13,1.27)
IND-SMD_L5.4-W5.2_FXL0530
  rect 1.9x2.5 smd: 1(-2.05,0) 2(2.05,0)
IND-SMD_L7.1-W6.6
  rect 2.15x3.32 smd: 1(-2.913,0) 2(2.913,0)
LL-34_L3.5-W1.5-RD
  rect 1.1x1.7 smd: 1(-1.7,0) 2(1.7,0)
M3螺丝
  round 3.2 hole 3.2: 1(-0.064,0.064)
R0603
  rect 0.806x0.864 smd: 1(-0.753,0) 2(0.753,0)
SOIC-8_L5.0-W4.0-P1.27-LS6.0-BL-EP2.0
  oval 0.574x2.038 smd: 1(-1.905,-2.769) 2(-0.635,-2.769) 3(0.635,-2.769) 4(1.905,-2.769) 5(1.905,2.769) 6(0.635,2.769) 7(-0.635,2.769) 8(-1.905,2.769)
  rect 2x2 smd: 9(0,0)

## Nets
As in the schematic, except:
GND: C5.1 C6.1 C8.1 C28.2 C29.1 C30.1 C31.1 C32.1 C33.2 C36.1 C37.1 C39.1 C40.2 C41.2 CN1.2 H1.4 H2.2 H3.2 H4.1 H5.1 H6.1 H7.1 P1.1 P1.2 P1.3 P1.4 P1.5 P1.6 P2.1 P2.2 P2.3 P2.4 P2.5 P2.6 P2.36 P2.38 P2.40 P3.2 P4.2 P5.2 P6.2 R3.1 R6.1 U21.9 U22.9

Pads without a net: H4 2; H6 2; SCREW4 1; SCREW5 1; SCREW6 1; SCREW7 1

## Via types
v1: diameter 0.61, hole 0.305, Top Layer to Bottom Layer, 41 vias

## Routing (per net, layer and track width the routed paths; a pad name or vN(x,y) marks a point on that pad's centre or on a via; arc(x,y) is an arc through that point)
3V3: length 145.7
  Top Layer w0.254: v1(46.13,67.53) 44.96,68.71 44.96,71.37 P6.5 ; v1(23.22,63.1) v1(25.66,65.54) ; D1.1 26.54,39.29 H6.3 ; H5.3 49.76,61.7 49.76,63.9 v1(48.49,65.17)
  Top Layer w0.508: H4.3 46.61,39.62 v1(46.61,36.7) ; P2.33 P2.35 ; v1(49.02,33.91) 52.7,30.23 P4.5 ; P3.5 19.69,34.67 H6.3
  Bottom Layer w0.254: H7.3 v1(23.22,63.1) ; v1(46.13,67.53) v1(48.49,65.17) ; P5.5 28.19,68.07 v1(25.66,65.54)
  Bottom Layer w0.508: v1(49.02,33.91) 49.02,34.29 v1(46.61,36.7) ; P2.35 11.62,30.16 13.33,30.16 14.03,29.46 14.03,27.75 14.73,27.05 19.43,27.05 19.79,27.41 19.79,27.92 19.69,28.02 P3.5 ; H4.3 44.7,41.91 42.19,44.43 29.31,44.43 28.96,44.07 28.96,43.94 H6.3 26.54,56.39 ; 26.54,56.39 21.59,61.34 H7.3 ; 26.54,56.39 30.24,60.09 34.3,60.09 37.97,63.75 47.75,63.75 49.66,61.85 H5.3
12V: length 71.7
  Top Layer w0.203: 46.24,49.4 44.6,51.04
  Top Layer w0.508: H5.2 50.29,59.69 36.92,59.69 36.7,59.91 ; 35.62,54.55 31.07,54.55 30.78,54.26 ; 30.78,54.26 30.78,55.2 29.14,56.85 R1.2 26.56,59.06 21.21,59.06 H7.2 ; 30.78,54.26 30.78,53.93
  Top Layer w1.016: 35.62,54.55 39.12,51.05 U22.8 44.6,52.07
  Top Layer w1.27: CN1.1 36.7,55.12 36.13,54.55 35.62,54.55
+5V: length 50.4
  Top Layer w0.254: 27.33,46.36 27.05,46.08 ; C7.2 30.58,47.92 R2.2
  Top Layer w0.508: C30.2 10.29,23.31 P2.39 P2.37 11.07,29.74 11.07,30.57 11.62,31.12 11.62,42.16 12.33,42.86 16.83,42.86 17.02,42.67 18.03,42.67 18.86,43.5 C31.2 18.78,44.18 18.78,46.09 ; 27.05,46.08 27.03,46.09 18.78,46.09 ; 25.09,46.08 25.12,46.05 25.12,43.27 ; C29.2 18.78,46.09 ; 18.78,46.09 C8.2 ; R2.2 27.33,46.36 26.92,46.36
GND: length 33.3
  Top Layer w0.203: U22.9 42.8,52.96 42.54,53.22 R6.1 ; 47.87,53.46 47.69,53.64 C40.2
  Top Layer w0.254: 46.87,52.46 46.87,47.82 C39.1
  Top Layer w0.508: 27.51,52.8 27.51,49.86 R3.1 ; C31.1 16.78,44.18 C29.1 ; C36.1 49.21,57.28 C40.2 ; H2.2 57.34,53.34 H3.2 ; P2.40 12.83,23.26 C30.1
+P_5V: length 36
  Top Layer w0.254: C39.2 45.4,49.21 v1(44.83,49.78)
  Top Layer w0.508: U29.1 53.3,45.94 50.83,45.94 ; H2.1 57.34,50.8 55.69,50.8 ; 55.69,50.8 50.83,45.94 ; 55.69,50.8 H3.1 ; v1(42.89,47.62) 44.79,45.72 50.61,45.72 50.83,45.94
  Bottom Layer w0.254: 42.04,58.04 v1(42.04,56.22) 42.04,54.24 45.35,50.93
  Bottom Layer w0.508: v1(42.89,47.62) 42.93,47.66 v1(42.93,48.4) v1(42.93,49.78) v1(44.83,49.78)
  vias: v1(41.97,57.79)
A00: length 35.2
  Top Layer w0.254: v1(24.9,57.03) 25.78,57.91 v1(25.78,58.17)
  Bottom Layer w0.254: P2.29 9.02,40.39 9.02,45.21 9.46,45.66 10.73,45.66 11.37,46.29 11.37,47.56 12.06,48.26 12.32,48.26 12.38,48.2 13.27,48.2 13.34,48.26 13.72,48.26 14.91,49.46 14.91,52.25 18.16,55.5 23.37,55.5 v1(24.9,57.03) ; v1(25.78,58.17) 25.78,59.56 H7.4
A03: length 39.1
  Top Layer w0.203: v1(20.7,39.12) 20.57,39.24 v1(15.11,39.24)
  Bottom Layer w0.203: P2.30 14.99,39.12 v1(15.11,39.24) ; H4.5 46.08,37.83 21.99,37.83 v1(20.7,39.12)
A05: length 16.5
  Top Layer w0.152: P2.28 12.83,40.57 18.6,34.8 v1(18.67,34.8)
  Bottom Layer w0.152: P3.4 22.22,31.24 v1(18.67,34.8)
A06: length 12.4
  Bottom Layer w0.203: P2.25 10.41,44.2 11.56,43.05 20.07,43.05 21.46,41.66 H6.5
A13/SWDIO: length 45
  Top Layer w0.152: H1.2 40.89,40.13 40.89,42.29 42.42,43.82 59.76,43.82 60.65,42.93 61.86,42.93 v1(62.13,43.19)
  Bottom Layer w0.152: P1.18 62.13,53.11 v1(62.13,43.19)
A14/SWCLK: length 38
  Top Layer w0.152: H1.3 43.56,40.26 43.56,42.93 43.94,43.31 58.8,43.31 59.31,42.8 v1(60.01,42.8)
  Bottom Layer w0.152: P1.19 59.81,50.79 59.81,43.77 60.07,43.5 60.07,42.86 v1(60.01,42.8)
AOUT1: length 17
  Top Layer w1.524: P5.1 22.35,67.31 26.03,67.31 ; H7.6 29.08,64.39 26.16,67.31
AOUT1B: length 17.4
  Top Layer w1.524: H5.6 43.8,63.36 44.56,63.36 48.51,67.31 51.05,67.31 54.74,70.99 P6.1
AOUT2: length 10.7
  Top Layer w1.524: H7.7 31.62,70.74 P5.6
AOUT2B: length 11.2
  Top Layer w1.524: P6.6 39.5,69.22 H5.7
B00: length 12.3
  Bottom Layer w0.203: H6.4 22.12,43.41 13.61,43.41 P2.26
B01: length 28.9
  Bottom Layer w0.254: P2.23 11.01,47.46 11.01,47.71 11.68,48.38 11.68,52.2 12.38,52.9 12.51,52.9 12.89,53.28 13.27,53.28 13.91,53.91 13.91,54.29 16.76,57.15 17.91,57.15 20.05,59.3 20.05,62.34 21.46,63.75 24.51,63.75 26.54,61.72 H7.5
B03: length 45.7
  Top Layer w0.152: P1.26 63.25,44.32 62.16,44.32 61.26,45.22 60.41,45.22 59.51,44.32 40,44.32 P3.3
B09: length 28.5
  Top Layer w0.203: P1.29 60.2,39.12 57.69,41.63 v1(57.69,42.45)
  Bottom Layer w0.203: H5.4 47.12,59.94 52.83,54.23 52.83,47.31 v1(57.69,42.45)
B14: length 56.9
  Top Layer w0.254: v1(19.81,64.9) 19.05,64.9 18.92,65.02 16.89,65.02 14.86,62.99 13.34,62.99 13.27,63.06 12.38,63.06 12.32,62.99 11.3,62.99 P2.11
  Bottom Layer w0.203: H2.3 57.38,63.78 56.45,64.71 48.88,64.71 48.77,64.59 47.88,64.59 47.88,64.64
  Bottom Layer w0.254: v1(19.81,64.9) 47.62,64.9 47.88,64.64
B15: length 49.6
  Top Layer w0.254: P2.12 14.99,61.98 15.48,62.47 16.62,62.47 v1(18.41,64.26)
  Bottom Layer w0.254: H3.3 53.59,56.77 53.59,62.74 52.09,64.24 18.44,64.24 v1(18.41,64.26)
BOUT1: length 18.8
  Bottom Layer w1.524: P3.1 24.76,34.16 21.72,34.16 18.92,36.96 H6.6
BOUT1B: length 16.4
  Top Layer w1.524: 52.2,41.53 52.2,40.13 42.54,30.48 P4.1
BOUT2: length 12.7
  Bottom Layer w1.524: P3.6 17.14,40.89 16.51,41.53
BOUT2B: length 12.7
  Top Layer w1.524: 54.74,41.53 54.74,29.59 P4.6
C06: length 43.4
  Top Layer w0.152: P1.10 62.99,64.14 61.91,64.14 61.26,63.49 60.41,63.49 59.76,64.14 59.56,64.14 v1(59.44,64.01)
  Bottom Layer w0.152: v1(59.44,64.01) 59.44,42.42 50.16,33.15 P4.4
C07: length 43.6
  Top Layer w0.152: v1(58.67,62.87) 58.81,63 61.26,63 61.4,62.87 62.48,62.87 P1.12
  Bottom Layer w0.152: v1(58.67,62.87) 58.67,42.81 58.8,42.68 49.53,33.41 49.53,30.99 P4.3
D12: length 16.1
  Bottom Layer w0.152: P6.4 49.91,68.96 59.65,68.96 60.83,67.78 P1.7
D13: length 15.7
  Bottom Layer w0.152: P6.3 52.07,69.34 59.63,69.34 60.41,68.57 61.86,68.57 P1.8
E05: length 21.5
  Top Layer w0.203: v1(48.13,38.48) 48.13,40.64 H4.4 ; v1(51.82,36.45) v1(53.21,35.05)
  Bottom Layer w0.203: v1(53.21,35.05) 57.02,35.05 59.53,32.55 61.94,32.55 62.99,31.5 P1.36 ; v1(48.13,38.48) 49.78,38.48 v1(51.82,36.45)
E06: length 37.9
  Top Layer w0.203: P1.35 59.06,31.5 57.02,33.53 v1(57.02,41.91)
  Bottom Layer w0.203: H5.5 52.47,53.71 52.47,46.47 v1(57.02,41.91)
E09: length 27.4
  Bottom Layer w0.152: P2.19 11.65,53.18 11.65,59.78 12.35,60.49 13.35,60.49 18.9,66.04 20.07,66.04 P5.4
E11: length 23.2
  Bottom Layer w0.152: P2.17 11.39,55.46 11.39,60.03 12.23,60.87 13.25,60.87 13.91,61.53 13.91,61.64 23.11,70.85 P5.3
$1N856: length 6.5
  Top Layer w1.524: L4.1 C3.2 22.69,53.93 U21.2
$1N857: length 6.1
  Top Layer w0.203: R3.2 27.48,48.01 R2.1
  Top Layer w0.254: 30.78,51.39 30.78,49.52 C7.1 28.93,49.46 R2.1
$1N858: length 5.7
  Top Layer w0.254: v1(24.38,51.39) U21.4 ; C5.2 v1(20.18,51.61)
  Bottom Layer w0.254: v1(24.38,51.39) 20.41,51.39 v1(20.18,51.61)
$1N864: length 12.1
  Top Layer w0.254: C6.2 v1(18.41,52.51) ; R1.1 27.27,55.34 26.66,54.73 26.66,53.21 26.11,52.66 U21.3
  Bottom Layer w0.254: v1(18.41,52.51) 18.56,52.66 v1(24.27,52.66)
$1N865: length 2.6
  Top Layer w0.254: C28.1 30.8,52.64 30.78,52.66
$1N867: length 3.5
  Top Layer w0.254: C3.1 23.23,57.21 U21.1
$1N1560: length 7.3
  Top Layer w0.203: C38.1 40.57,54.61 44.35,54.61 U22.5
$1N1561: length 2.5
  Top Layer w0.203: C36.2 50.86,55.59 U22.4
$1N1567: length 7.4
  Top Layer w0.508: v1(48.11,49.38) 48.32,49.17 C37.2
  Bottom Layer w0.203: v1(49.28,53.59) 49.28,50.55 v1(48.11,49.38)
$1N1568: length 2.8
  Bottom Layer w0.508: v1(44.51,56.39) 44.6,56.29 v1(44.6,53.59)
$1N1570: length 2
  Top Layer w0.508: U22.1 50.1,51.01 C42.1
$1N2169: length 6.2
  Bottom Layer w0.254: v1(26.67,35.77) 28.53,33.91 H1.1
$1N7357: length 2
  Top Layer w0.508: 51.5,49.02 v1(51.5,50.42)
  Top Layer w1.016: v1(51.27,52.32) v1(51.91,52.32)
  vias: v1(50.62,52.32)

## Copper pours and planes (outline as drawn; the poured copper is in the pictures)
GND on Top Layer: -11.05,106.68 85.72,106.68 85.72,-13.33 -11.05,-13.33
GND on Bottom Layer: -10.8,107.95 85.98,107.95 85.98,-13.33 -10.8,-13.33

## Text on the board
Top Silkscreen Layer: GND | M- | M+ | A1 | B1 | DEBUG | A2 | B2 | 407核心板倒装 | 注意插接方向和正反，不要插错/焊错
